# Altium schematic sheet top.SchDoc
size A4; SheetNumber: 1; SheetTotal: 3
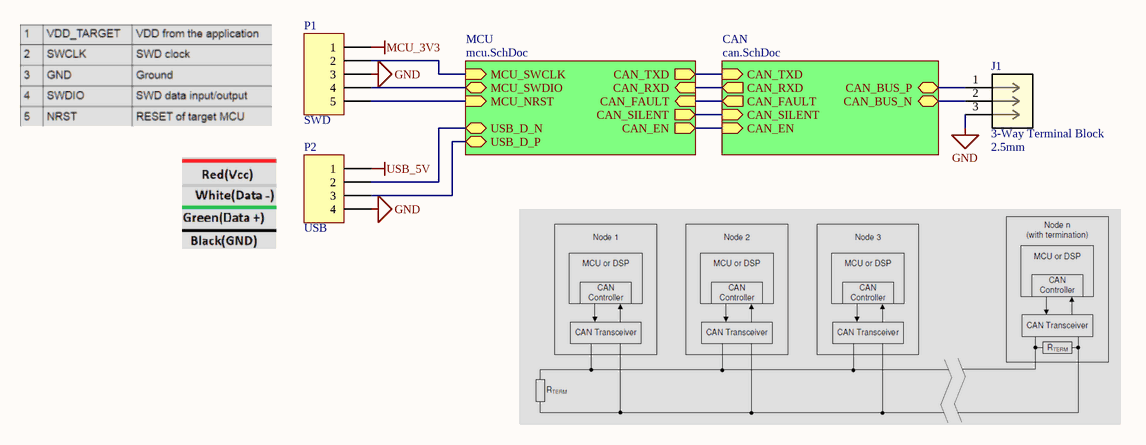
[diagram p0: top.SchDoc]

## Parts
J1  3-Way Terminal Block  value 2.5mm  [TERMINAL_BLOCK_2.5MM_3WAY]
P1  Pin Header 5  [PIN_HEADER_1X5]  (value not drawn)
P2  Pin Header 4  [PIN_HEADER_1X4]  (value not drawn)

## Sub-sheets
CAN = can.SchDoc: CAN_TXD (in), CAN_RXD (out), CAN_FAULT (out), CAN_SILENT (in), CAN_EN (in), CAN_BUS_P (bidir), CAN_BUS_N (bidir)
MCU = mcu.SchDoc: USB_D_P (bidir), USB_D_N (bidir), MCU_SWCLK (in), MCU_SWDIO (bidir), CAN_TXD (out), CAN_SILENT (out), CAN_RXD (in), CAN_FAULT (in), CAN_EN (out), MCU_NRST (in)

## Nets
GND: J1.3 P1.3 P2.4
MCU_3V3: P1.1
USB_5V: P2.1
NetJ1_1: J1.1 ; sheet CAN/CAN_BUS_P
NetJ1_2: J1.2 ; sheet CAN/CAN_BUS_N
NetP1_2: P1.2 ; sheet MCU/MCU_SWCLK
NetP1_4: P1.4 ; sheet MCU/MCU_SWDIO
NetP1_5: P1.5 ; sheet MCU/MCU_NRST
NetP2_2: P2.2 ; sheet MCU/USB_D_N
NetP2_3: P2.3 ; sheet MCU/USB_D_P
(unnamed): sheet CAN/CAN_TXD, sheet MCU/CAN_TXD
(unnamed): sheet CAN/CAN_RXD, sheet MCU/CAN_RXD
(unnamed): sheet CAN/CAN_FAULT, sheet MCU/CAN_FAULT
(unnamed): sheet CAN/CAN_SILENT, sheet MCU/CAN_SILENT
(unnamed): sheet CAN/CAN_EN, sheet MCU/CAN_EN

## Notes on the sheet
- (near P1) SWD
- (near P2) USB

## Library data of the parts
J1 = 3-Way Terminal Block: 3-way wire to board terminal block; Part Number: *; Manufacturer: *
P1 = Pin Header 5: pin header, 5-pin
P2 = Pin Header 4: pin header, 4-pin